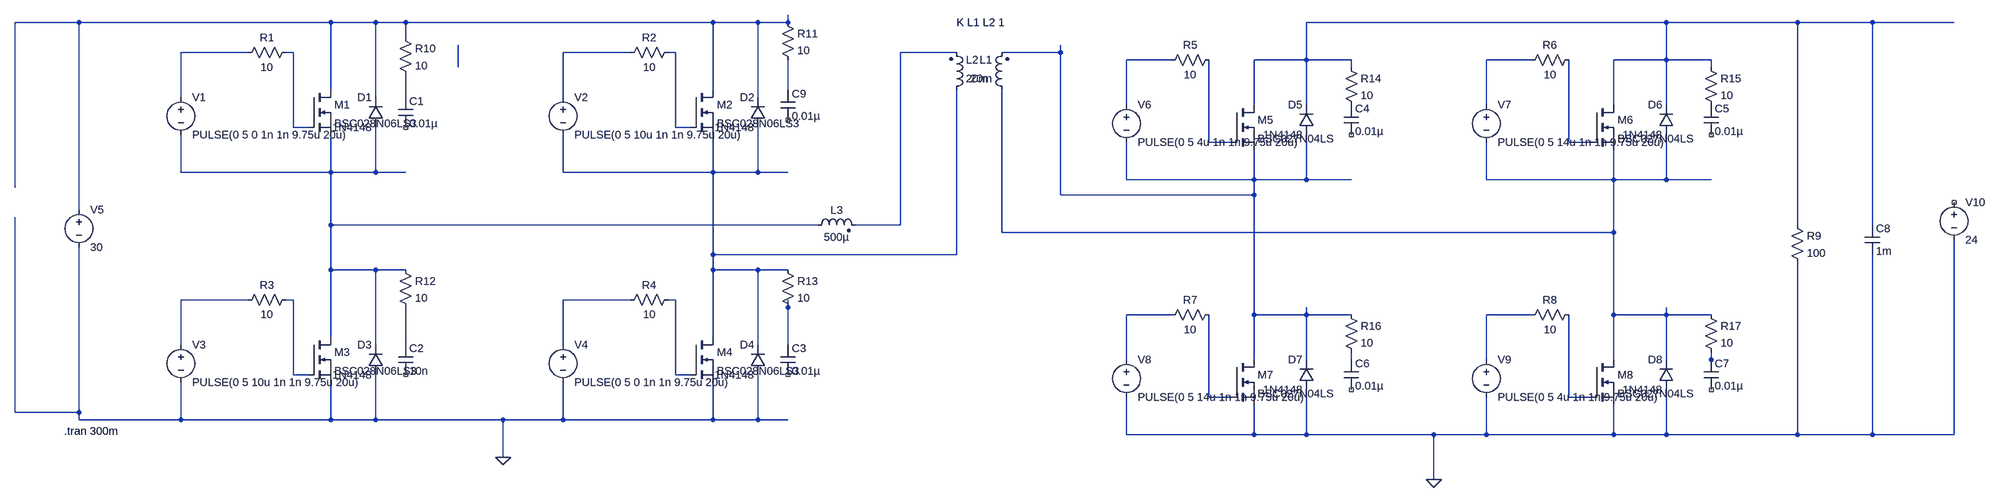
[diagram p0: schematic Draft16.asc]
Draft16.asc, the LTspice schematic file:
Version 4
SHEET 1 2232 756
WIRE -2144 -240 -2384 -240
WIRE -1600 -240 -2144 -240
WIRE -1504 -240 -1600 -240
WIRE -1440 -240 -1504 -240
WIRE -784 -240 -1440 -240
WIRE -688 -240 -784 -240
WIRE -624 -240 -624 -256
WIRE -624 -240 -688 -240
WIRE 1424 -240 656 -240
WIRE 1824 -240 1424 -240
WIRE 1984 -240 1824 -240
WIRE 2160 -240 1984 -240
WIRE -1440 -208 -1440 -240
WIRE -1776 -176 -1920 -176
WIRE -1680 -176 -1696 -176
WIRE -960 -176 -1104 -176
WIRE -864 -176 -880 -176
WIRE -192 -176 -384 -176
WIRE 96 -176 96 -192
WIRE 96 -176 -96 -176
WIRE 368 -160 272 -160
WIRE 656 -160 656 -240
WIRE 656 -160 544 -160
WIRE 752 -160 656 -160
WIRE 1136 -160 1040 -160
WIRE 1424 -160 1424 -240
WIRE 1424 -160 1312 -160
WIRE 1520 -160 1424 -160
WIRE -1328 -144 -1328 -192
WIRE 752 -144 752 -160
WIRE 1520 -144 1520 -160
WIRE -1600 -96 -1600 -240
WIRE -784 -96 -784 -240
WIRE -624 -96 -624 -160
WIRE -1920 -80 -1920 -176
WIRE -1504 -80 -1504 -240
WIRE -1440 -80 -1440 -128
WIRE -1104 -80 -1104 -176
WIRE -688 -80 -688 -240
WIRE 272 -64 272 -160
WIRE 544 -64 544 -160
WIRE 656 -64 656 -160
WIRE 1040 -64 1040 -160
WIRE 1312 -64 1312 -160
WIRE 1424 -64 1424 -160
WIRE -1680 -16 -1680 -176
WIRE -1648 -16 -1680 -16
WIRE -864 -16 -864 -176
WIRE -832 -16 -864 -16
WIRE 448 16 448 -160
WIRE 496 16 448 16
WIRE 1216 16 1216 -160
WIRE 1264 16 1216 16
WIRE -1920 80 -1920 0
WIRE -1600 80 -1600 0
WIRE -1600 80 -1920 80
WIRE -1504 80 -1504 -16
WIRE -1504 80 -1600 80
WIRE -1440 80 -1504 80
WIRE -1104 80 -1104 0
WIRE -784 80 -784 0
WIRE -784 80 -1104 80
WIRE -688 80 -688 -16
WIRE -688 80 -784 80
WIRE -624 80 -688 80
WIRE 272 96 272 16
WIRE 544 96 544 32
WIRE 544 96 272 96
WIRE 656 96 656 0
WIRE 656 96 544 96
WIRE 752 96 656 96
WIRE 1040 96 1040 16
WIRE 1312 96 1312 32
WIRE 1312 96 1040 96
WIRE 1424 96 1424 0
WIRE 1424 96 1312 96
WIRE 1520 96 1424 96
WIRE -2384 112 -2384 -240
WIRE 96 128 96 -176
WIRE 544 128 544 96
WIRE 544 128 96 128
WIRE -2144 160 -2144 -240
WIRE -1600 192 -1600 80
WIRE -560 192 -1600 192
WIRE -384 192 -384 -176
WIRE -384 192 -480 192
WIRE 1824 192 1824 -240
WIRE 1984 192 1984 -240
WIRE -96 208 -96 -96
WIRE 1312 208 1312 96
WIRE 1312 208 -96 208
WIRE -784 256 -784 80
WIRE -192 256 -192 -96
WIRE -192 256 -784 256
WIRE -1600 288 -1600 192
WIRE -1504 288 -1600 288
WIRE -1440 288 -1504 288
WIRE -784 288 -784 256
WIRE -688 288 -784 288
WIRE -624 288 -688 288
WIRE -1776 352 -1920 352
WIRE -1680 352 -1696 352
WIRE -960 352 -1104 352
WIRE -864 352 -880 352
WIRE -624 368 -624 352
WIRE 368 384 272 384
WIRE 544 384 544 128
WIRE 656 384 656 368
WIRE 656 384 544 384
WIRE 752 384 656 384
WIRE 1136 384 1040 384
WIRE 1312 384 1312 208
WIRE 1424 384 1424 368
WIRE 1424 384 1312 384
WIRE 1520 384 1424 384
WIRE -1600 432 -1600 288
WIRE -784 432 -784 288
WIRE -1920 448 -1920 352
WIRE -1504 448 -1504 288
WIRE -1440 448 -1440 368
WIRE -1104 448 -1104 352
WIRE -688 448 -688 288
WIRE -624 448 -624 368
WIRE 272 480 272 384
WIRE 544 480 544 384
WIRE 656 480 656 384
WIRE 752 480 752 464
WIRE 1040 480 1040 384
WIRE 1312 480 1312 384
WIRE 1424 480 1424 384
WIRE 1520 480 1520 464
WIRE 1520 496 1520 480
WIRE -1680 512 -1680 352
WIRE -1648 512 -1680 512
WIRE -864 512 -864 352
WIRE -832 512 -864 512
WIRE 448 560 448 384
WIRE 496 560 448 560
WIRE 1216 560 1216 384
WIRE 1264 560 1216 560
WIRE -2384 592 -2384 176
WIRE -2144 592 -2144 240
WIRE -2144 592 -2384 592
WIRE -2144 608 -2144 592
WIRE -1920 608 -1920 528
WIRE -1920 608 -2144 608
WIRE -1600 608 -1600 528
WIRE -1600 608 -1920 608
WIRE -1504 608 -1504 512
WIRE -1504 608 -1600 608
WIRE -1232 608 -1504 608
WIRE -1104 608 -1104 528
WIRE -1104 608 -1232 608
WIRE -784 608 -784 528
WIRE -784 608 -1104 608
WIRE -688 608 -688 512
WIRE -688 608 -784 608
WIRE -624 608 -688 608
WIRE 272 640 272 560
WIRE 544 640 544 576
WIRE 544 640 272 640
WIRE 656 640 656 544
WIRE 656 640 544 640
WIRE 928 640 656 640
WIRE 1040 640 1040 560
WIRE 1040 640 928 640
WIRE 1312 640 1312 576
WIRE 1312 640 1040 640
WIRE 1424 640 1424 544
WIRE 1424 640 1312 640
WIRE 1824 640 1824 272
WIRE 1824 640 1424 640
WIRE 1984 640 1984 256
WIRE 1984 640 1824 640
WIRE 2160 640 2160 224
WIRE 2160 640 1984 640
WIRE -1232 688 -1232 608
WIRE 928 736 928 640
FLAG -1232 688 0
FLAG 928 736 0
DATAFLAG -256 -176 "$-V(N014)"
DATAFLAG -608 192 "$-V(N017)"
DATAFLAG -672 192 "$-V(N017)"
SYMBOL voltage -1920 -96 R0
WINDOW 123 0 0 Left 0
WINDOW 39 0 0 Left 0
SYMATTR InstName V1
SYMATTR Value PULSE(0 5 0 1n 1n 9.75u 20u)
SYMBOL res -1680 -192 R90
WINDOW 0 0 56 VBottom 2
WINDOW 3 32 56 VTop 2
SYMATTR InstName R1
SYMATTR Value 10
SYMBOL nmos -1648 -96 R0
SYMATTR InstName M1
SYMATTR Value BSC028N06LS3
SYMBOL diode -1488 -16 R180
WINDOW 0 24 64 Left 2
WINDOW 3 24 0 Left 2
SYMATTR InstName D1
SYMATTR Value 1N4148
SYMBOL cap -1456 -80 R0
SYMATTR InstName C1
SYMATTR Value 0.01µ
SYMBOL voltage -1104 -96 R0
WINDOW 123 0 0 Left 0
WINDOW 39 0 0 Left 0
SYMATTR InstName V2
SYMATTR Value PULSE(0 5 10u 1n 1n 9.75u 20u)
SYMBOL res -864 -192 R90
WINDOW 0 0 56 VBottom 2
WINDOW 3 32 56 VTop 2
SYMATTR InstName R2
SYMATTR Value 10
SYMBOL nmos -832 -96 R0
SYMATTR InstName M2
SYMATTR Value BSC028N06LS3
SYMBOL diode -672 -16 R180
WINDOW 0 24 64 Left 2
WINDOW 3 24 0 Left 2
SYMATTR InstName D2
SYMATTR Value 1N4148
SYMBOL voltage -1920 432 R0
WINDOW 123 0 0 Left 0
WINDOW 39 0 0 Left 0
SYMATTR InstName V3
SYMATTR Value PULSE(0 5 10u 1n 1n 9.75u 20u)
SYMBOL res -1680 336 R90
WINDOW 0 0 56 VBottom 2
WINDOW 3 32 56 VTop 2
SYMATTR InstName R3
SYMATTR Value 10
SYMBOL nmos -1648 432 R0
SYMATTR InstName M3
SYMATTR Value BSC028N06LS3
SYMBOL diode -1488 512 R180
WINDOW 0 24 64 Left 2
WINDOW 3 24 0 Left 2
SYMATTR InstName D3
SYMATTR Value 1N4148
SYMBOL cap -1456 448 R0
SYMATTR InstName C2
SYMATTR Value 10n
SYMBOL voltage -1104 432 R0
WINDOW 123 0 0 Left 0
WINDOW 39 0 0 Left 0
SYMATTR InstName V4
SYMATTR Value PULSE(0 5 0 1n 1n 9.75u 20u)
SYMBOL res -864 336 R90
WINDOW 0 0 56 VBottom 2
WINDOW 3 32 56 VTop 2
SYMATTR InstName R4
SYMATTR Value 10
SYMBOL nmos -832 432 R0
SYMATTR InstName M4
SYMATTR Value BSC028N06LS3
SYMBOL diode -672 512 R180
WINDOW 0 24 64 Left 2
WINDOW 3 24 0 Left 2
SYMATTR InstName D4
SYMATTR Value 1N4148
SYMBOL cap -640 448 R0
SYMATTR InstName C3
SYMATTR Value 0.01µ
SYMBOL voltage -2144 144 R0
WINDOW 123 0 0 Left 0
WINDOW 39 0 0 Left 0
SYMATTR InstName V5
SYMATTR Value 30
SYMBOL ind2 -80 -80 R180
WINDOW 0 36 80 Left 2
WINDOW 3 36 40 Left 2
SYMATTR InstName L1
SYMATTR Value 20m
SYMATTR Type ind
SYMBOL voltage 272 -80 R0
WINDOW 123 0 0 Left 0
WINDOW 39 0 0 Left 0
SYMATTR InstName V6
SYMATTR Value PULSE(0 5 4u 1n 1n 9.75u 20u)
SYMBOL res 352 -144 R270
WINDOW 0 32 56 VTop 2
WINDOW 3 0 56 VBottom 2
SYMATTR InstName R5
SYMATTR Value 10
SYMBOL nmos 496 -64 R0
SYMATTR InstName M5
SYMATTR Value BSC027N04LS
SYMBOL diode 672 0 R180
WINDOW 0 24 64 Left 2
WINDOW 3 24 0 Left 2
SYMATTR InstName D5
SYMATTR Value 1N4148
SYMBOL cap 736 -64 R0
SYMATTR InstName C4
SYMATTR Value 0.01µ
SYMBOL voltage 1040 -80 R0
WINDOW 123 0 0 Left 0
WINDOW 39 0 0 Left 0
SYMATTR InstName V7
SYMATTR Value PULSE(0 5 14u 1n 1n 9.75u 20u)
SYMBOL res 1120 -144 R270
WINDOW 0 32 56 VTop 2
WINDOW 3 0 56 VBottom 2
SYMATTR InstName R6
SYMATTR Value 10
SYMBOL nmos 1264 -64 R0
SYMATTR InstName M6
SYMATTR Value BSC027N04LS
SYMBOL diode 1440 0 R180
WINDOW 0 24 64 Left 2
WINDOW 3 24 0 Left 2
SYMATTR InstName D6
SYMATTR Value 1N4148
SYMBOL cap 1504 -64 R0
SYMATTR InstName C5
SYMATTR Value 0.01µ
SYMBOL voltage 272 464 R0
WINDOW 123 0 0 Left 0
WINDOW 39 0 0 Left 0
SYMATTR InstName V8
SYMATTR Value PULSE(0 5 14u 1n 1n 9.75u 20u)
SYMBOL res 352 400 R270
WINDOW 0 32 56 VTop 2
WINDOW 3 0 56 VBottom 2
SYMATTR InstName R7
SYMATTR Value 10
SYMBOL nmos 496 480 R0
SYMATTR InstName M7
SYMATTR Value BSC027N04LS
SYMBOL diode 672 544 R180
WINDOW 0 24 64 Left 2
WINDOW 3 24 0 Left 2
SYMATTR InstName D7
SYMATTR Value 1N4148
SYMBOL cap 736 480 R0
SYMATTR InstName C6
SYMATTR Value 0.01µ
SYMBOL voltage 1040 464 R0
WINDOW 123 0 0 Left 0
WINDOW 39 0 0 Left 0
SYMATTR InstName V9
SYMATTR Value PULSE(0 5 4u 1n 1n 9.75u 20u)
SYMBOL res 1120 400 R270
WINDOW 0 32 56 VTop 2
WINDOW 3 0 56 VBottom 2
SYMATTR InstName R8
SYMATTR Value 10
SYMBOL nmos 1264 480 R0
SYMATTR InstName M8
SYMATTR Value BSC027N04LS
SYMBOL diode 1440 544 R180
WINDOW 0 24 64 Left 2
WINDOW 3 24 0 Left 2
SYMATTR InstName D8
SYMATTR Value 1N4148
SYMBOL cap 1504 480 R0
SYMATTR InstName C7
SYMATTR Value 0.01µ
SYMBOL res 1808 176 R0
SYMATTR InstName R9
SYMATTR Value 100
SYMBOL cap 1968 192 R0
SYMATTR InstName C8
SYMATTR Value 1m
SYMBOL ind2 -208 -80 M180
WINDOW 0 36 80 Left 2
WINDOW 3 36 40 Left 2
SYMATTR InstName L2
SYMATTR Value 20m
SYMATTR Type ind
SYMBOL voltage 2160 128 R0
WINDOW 123 0 0 Left 0
WINDOW 39 0 0 Left 0
SYMATTR InstName V10
SYMATTR Value 24
SYMBOL res -1456 -224 R0
SYMATTR InstName R10
SYMATTR Value 10
SYMBOL res -640 -256 R0
SYMATTR InstName R11
SYMATTR Value 10
SYMBOL cap -640 -96 R0
SYMATTR InstName C9
SYMATTR Value 0.01µ
SYMBOL res -1456 272 R0
SYMATTR InstName R12
SYMATTR Value 10
SYMBOL res -640 272 R0
SYMATTR InstName R13
SYMATTR Value 10
SYMBOL res 736 -160 R0
SYMATTR InstName R14
SYMATTR Value 10
SYMBOL res 1504 -160 R0
SYMATTR InstName R15
SYMATTR Value 10
SYMBOL res 736 368 R0
SYMATTR InstName R16
SYMATTR Value 10
SYMBOL res 1504 368 R0
SYMATTR InstName R17
SYMATTR Value 10
SYMBOL ind2 -576 208 R270
WINDOW 0 32 56 VTop 2
WINDOW 3 5 56 VBottom 2
SYMATTR InstName L3
SYMATTR Value 500µ
SYMATTR Type ind
TEXT -2176 632 Left 2 !.tran 300m
TEXT -192 -240 Left 2 !K L1 L2 1

The netlist it stands for:
* Draft16.asc
V1 N003 N016 PULSE(0 5 0 1n 1n 9.75u 20u)
R1 N004 N003 10
M1 N001 N004 N016 N016 BSC028N06LS3
D1 N016 N001 1N4148
C1 N013 NC_01 0.01µ
V2 N005 N017 PULSE(0 5 10u 1n 1n 9.75u 20u)
R2 N006 N005 10
M2 N001 N006 N017 N017 BSC028N06LS3
D2 N017 N001 1N4148
V3 N019 0 PULSE(0 5 10u 1n 1n 9.75u 20u)
R3 N020 N019 10
M3 N016 N020 0 0 BSC028N06LS3
D3 0 N016 1N4148
C2 N026 NC_02 10n
V4 N021 0 PULSE(0 5 0 1n 1n 9.75u 20u)
R4 N022 N021 10
M4 N017 N022 0 0 BSC028N06LS3
D4 0 N017 1N4148
C3 N023 NC_03 0.01µ
V5 N001 0 30
L1 N018 N008 20m
V6 N009 N008 PULSE(0 5 4u 1n 1n 9.75u 20u)
R5 N009 N014 10
M5 N002 N014 N008 N008 BSC027N04LS
D5 N008 N002 1N4148
C4 P001 NC_04 0.01µ
V7 N010 N018 PULSE(0 5 14u 1n 1n 9.75u 20u)
R6 N010 N015 10
M6 N002 N015 N018 N018 BSC027N04LS
D6 N018 N002 1N4148
C5 P002 NC_05 0.01µ
V8 N024 0 PULSE(0 5 14u 1n 1n 9.75u 20u)
R7 N024 N029 10
M7 N008 N029 0 0 BSC027N04LS
D7 0 N008 1N4148
C6 N027 NC_06 0.01µ
V9 N025 0 PULSE(0 5 4u 1n 1n 9.75u 20u)
R8 N025 N030 10
M8 N018 N030 0 0 BSC027N04LS
D8 0 N018 1N4148
C7 N028 NC_07 0.01µ
R9 N002 0 100
C8 N002 0 1m
L2 N017 N007 20m
V10 NC_08 0 24
R10 N001 N013 10
R11 N001 N012 10
C9 N012 NC_09 0.01µ
R12 N016 N026 10
R13 N017 N023 10
R14 N002 P001 10
R15 N002 P002 10
R16 N008 N027 10
R17 N018 N028 10
L3 N016 N007 500µ
.model D D
.lib standard.dio
.model NMOS NMOS
.model PMOS PMOS
.lib standard.mos
.tran 300m
K L1 L2 1
.backanno
.end